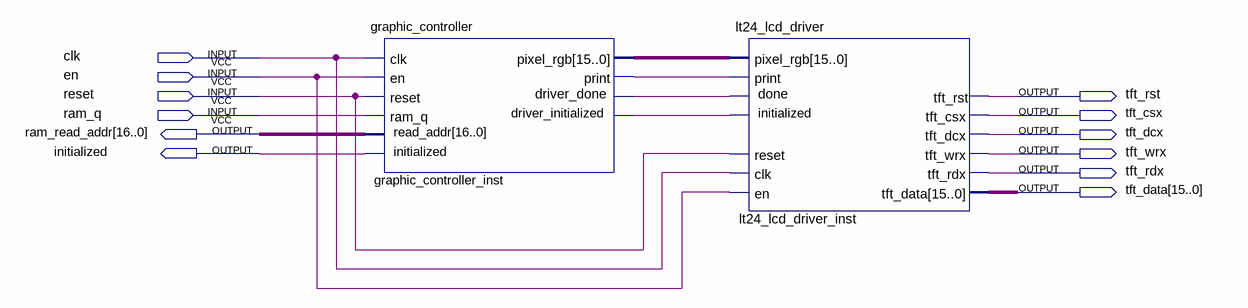
[diagram p0: schematic sheet]
// Quartus schematic graphic_manager.bdf as structural Verilog: 2 symbols, 12 pins
module graphic_manager (
  input  clk,
  input  en,
  input  reset,
  input  ram_q,
  output tft_rst,
  output tft_csx,
  output [16:0] ram_read_addr,
  output tft_dcx,
  output initialized,
  output tft_wrx,
  output tft_rdx,
  output [15:0] tft_data
);

  wire graphic_controller_inst_print, lt24_lcd_driver_inst_done, lt24_lcd_driver_inst_initialized;
  wire [15:0] graphic_controller_inst_pixel_rgb;

  graphic_controller graphic_controller_inst (
    .clk(clk), .en(en), .reset(reset), .ram_q(ram_q), .driver_done(lt24_lcd_driver_inst_done),
    .driver_initialized(lt24_lcd_driver_inst_initialized), .initialized(initialized),
    .read_addr(ram_read_addr), .pixel_rgb(graphic_controller_inst_pixel_rgb),
    .print(graphic_controller_inst_print));
  lt24_lcd_driver lt24_lcd_driver_inst (
    .clk(clk), .en(en), .reset(reset), .pixel_rgb(graphic_controller_inst_pixel_rgb),
    .print(graphic_controller_inst_print), .done(lt24_lcd_driver_inst_done),
    .initialized(lt24_lcd_driver_inst_initialized), .tft_rst(tft_rst), .tft_csx(tft_csx), .tft_dcx(tft_dcx),
    .tft_wrx(tft_wrx), .tft_rdx(tft_rdx), .tft_data(tft_data));
endmodule
